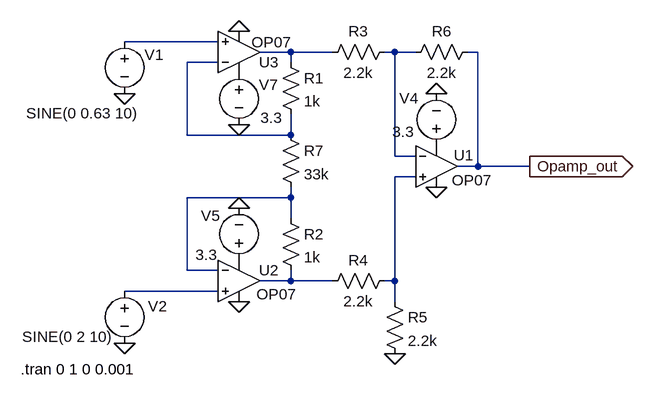
[diagram p0: schematic Amplifier.asc]
Amplifier.asc, the LTspice schematic file:
Version 4
SHEET 1 960 680
WIRE 32 -96 -112 -96
WIRE 144 -80 96 -80
WIRE 208 -80 144 -80
WIRE 304 -80 288 -80
WIRE 336 -80 304 -80
WIRE 432 -80 416 -80
WIRE 32 -64 -16 -64
WIRE 144 -64 144 -80
WIRE -16 48 -16 -64
WIRE 144 48 144 16
WIRE 144 48 -16 48
WIRE 304 80 304 -80
WIRE 336 80 304 80
WIRE 432 96 432 -80
WIRE 432 96 400 96
WIRE 512 96 432 96
WIRE 336 112 304 112
WIRE 144 144 144 128
WIRE 144 144 -16 144
WIRE 144 176 144 144
WIRE -16 256 -16 144
WIRE 32 256 -16 256
WIRE 144 272 144 256
WIRE 144 272 96 272
WIRE 208 272 144 272
WIRE 304 272 304 112
WIRE 304 272 288 272
WIRE 32 288 -112 288
WIRE 304 304 304 272
FLAG 304 384 0
FLAG 512 96 Opamp_out
IOPIN 512 96 Out
FLAG -112 -16 0
FLAG -112 368 0
FLAG 368 -16 0
FLAG 64 32 0
FLAG 64 160 0
FLAG 64 -112 0
FLAG 64 304 0
FLAG 368 128 0
SYMBOL res 128 -80 R0
SYMATTR InstName R1
SYMATTR Value 1k
SYMBOL res 128 160 R0
SYMATTR InstName R2
SYMATTR Value 1k
SYMBOL res 304 -96 R90
WINDOW 0 0 56 VBottom 2
WINDOW 3 32 56 VTop 2
SYMATTR InstName R3
SYMATTR Value 2.2k
SYMBOL res 304 256 R90
WINDOW 0 0 56 VBottom 2
WINDOW 3 32 56 VTop 2
SYMATTR InstName R4
SYMATTR Value 2.2k
SYMBOL res 288 288 R0
SYMATTR InstName R5
SYMATTR Value 2.2k
SYMBOL res 432 -96 R90
WINDOW 0 0 56 VBottom 2
WINDOW 3 32 56 VTop 2
SYMATTR InstName R6
SYMATTR Value 2.2k
SYMBOL res 128 32 R0
SYMATTR InstName R7
SYMATTR Value 33k
SYMBOL voltage -112 -112 R0
WINDOW 0 31 36 Left 2
WINDOW 3 -152 126 Left 2
WINDOW 123 31 64 Left 2
WINDOW 39 0 0 Left 0
SYMATTR InstName V1
SYMATTR Value SINE(0 0.63 10)
SYMBOL voltage -112 272 R0
WINDOW 0 36 39 Left 2
WINDOW 3 -158 86 Left 2
WINDOW 123 38 115 Left 2
WINDOW 39 0 0 Left 0
SYMATTR InstName V2
SYMATTR Value SINE(0 2 10)
SYMBOL voltage 368 80 R180
WINDOW 0 28 89 Left 2
WINDOW 3 34 37 Left 2
WINDOW 123 0 0 Left 0
WINDOW 39 0 0 Left 0
SYMATTR InstName V4
SYMATTR Value 3.3
SYMBOL voltage 64 256 R180
WINDOW 0 29 84 Left 2
WINDOW 3 33 24 Left 2
WINDOW 123 0 0 Left 0
WINDOW 39 0 0 Left 0
SYMATTR InstName V5
SYMATTR Value 3.3
SYMBOL voltage 64 -64 R0
WINDOW 0 31 34 Left 2
WINDOW 3 33 85 Left 2
WINDOW 123 0 0 Left 0
WINDOW 39 0 0 Left 0
SYMATTR InstName V7
SYMATTR Value 3.3
SYMBOL Opamps\\OP07 368 32 R0
WINDOW 0 27 47 Left 2
WINDOW 3 24 85 Left 2
SYMATTR InstName U1
SYMBOL Opamps\\OP07 64 208 R0
WINDOW 0 31 48 Left 2
WINDOW 3 27 85 Left 2
SYMATTR InstName U2
SYMBOL Opamps\\OP07 64 -16 M180
WINDOW 0 31 48 Left 2
WINDOW 3 19 79 Left 2
SYMATTR InstName U3
TEXT -272 408 Left 2 !.tran 0 1 0 0.001

The netlist it stands for:
* Amplifier.asc
R1 N002 N004 1k
R2 N006 N007 1k
R3 N003 N002 2.2k
R4 N005 N007 2.2k
R5 N005 0 2.2k
R6 Opamp_out N003 2.2k
R7 N004 N006 33k
V1 N001 0 SINE(0 0.63 10)
V2 N008 0 SINE(0 2 10)
V4 P001 0 3.3
V5 P002 0 3.3
V7 P003 0 3.3
XU1 N005 N003 P001 0 Opamp_out LT1001  ; OP07, pins In+ In- V+ V- OUT
XU2 N008 N006 P002 0 N007 LT1001  ; OP07, pins In+ In- V+ V- OUT
XU3 N001 N004 P003 0 N002 LT1001  ; OP07, pins In+ In- V+ V- OUT
.tran 0 1 0 0.001
.lib LTC.lib
.backanno
.end